# Altium project controller.PrjPcb
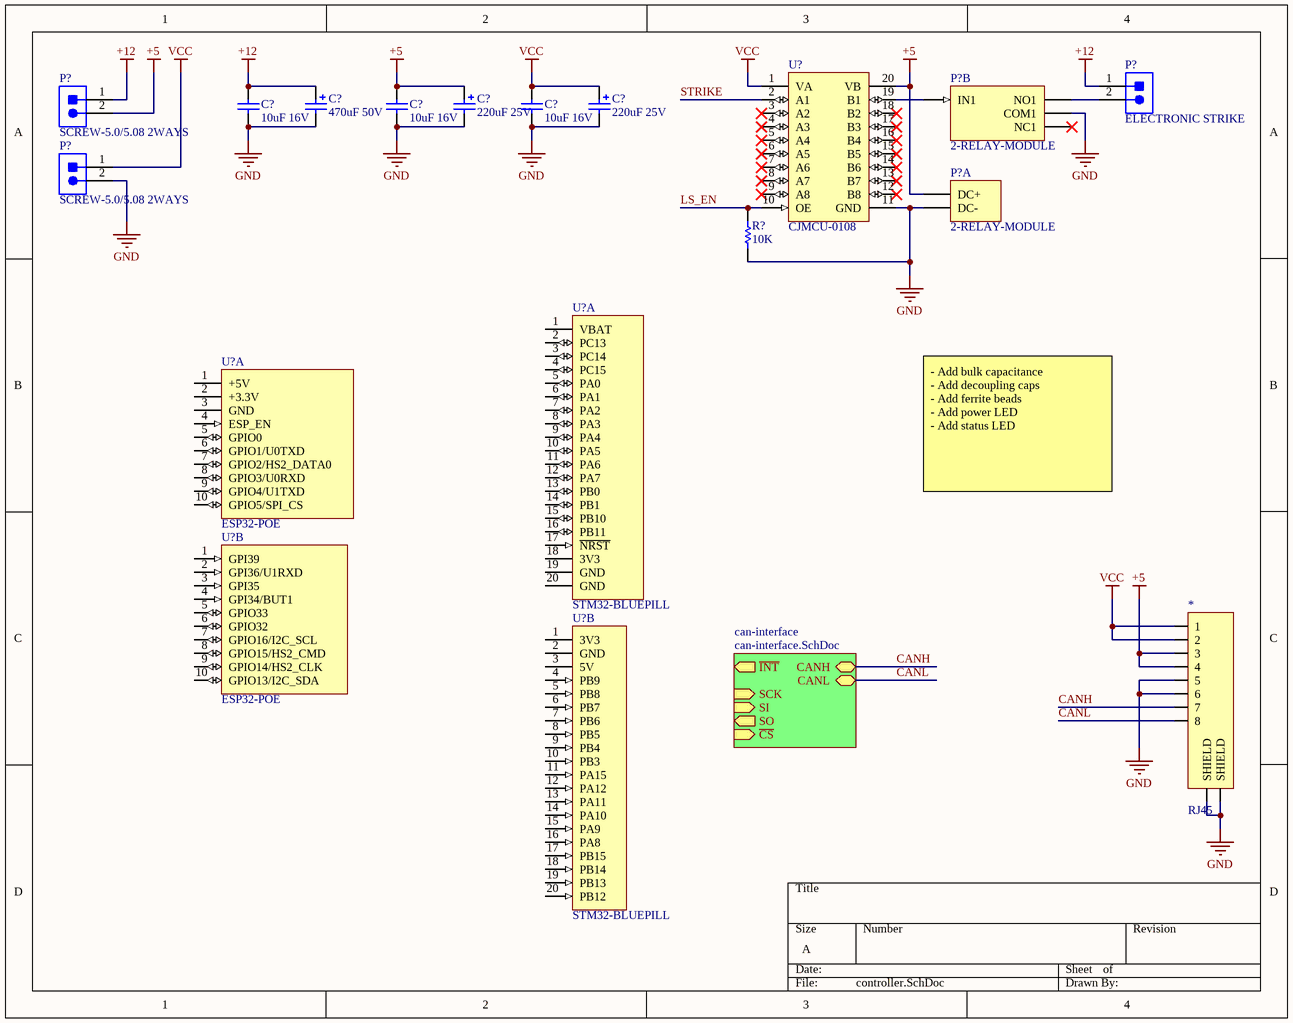
[diagram p0: controller.SchDoc]
3 sheets, 46 parts. Net scope: hierarchical (ports join the sheet entries above them; power ports are global).
Sheets:
  controller.SchDoc
    can-interface = can-interface.SchDoc
  keypad.SchDoc
    can-interface = can-interface.SchDoc

## Sheet controller.SchDoc
size A

### Parts
(Parts that share a designator on the sheet are numbered #1, #2 ... from top to bottom, then left to right.)
*  RJ45
C?#1  470uF 50V  [RB7.6-15]
C?#2  220uF 25V  [RB7.6-15]
C?#3  220uF 25V  [RB7.6-15]
C?#4  10uF 16V  [CAPC0805(2012)145_L]
C?#5  10uF 16V  [CAPC0805(2012)145_L]
C?#6  10uF 16V  [CAPC0805(2012)145_L]
P?#1  ELECTRONIC STRIKE  [SCREW-5.0-2WAYS_V]
P?#2  SCREW-5.0/5.08 2WAYS  [SCREW-5.0-2WAYS_V]
P?#3  2-RELAY-MODULE  (part B of 3)
P?#4  SCREW-5.0/5.08 2WAYS  [SCREW-5.0-2WAYS_V]
P?#5  2-RELAY-MODULE  (part A of 3)
R?  10K  [RESC0603(1608)_N]
U?#1  CJMCU-0108
U?#2  STM32-BLUEPILL  (part A of 2)
U?#3  ESP32-POE  (part A of 2)
U?#4  ESP32-POE  (part B of 2)
U?#5  STM32-BLUEPILL  (part B of 2)

### Sub-sheets
can-interface = can-interface.SchDoc: SO (out), SI (in), CANH (bidir), ~{CS} (in), CANL (bidir), SCK (in), ~{INT} (out)

### Nets
+5: *.3 *.4 C?#2.1 C?#5.2 P?#2.2 P?#5.1(DC+) U?#1.20(VB)
+12: C?#1.1 C?#4.2 P?#1.1 P?#2.1
GND: *.5 *.6 *.9(SHIELD) *.10(SHIELD) C?#1.2 C?#2.2 C?#3.2 C?#4.1 C?#5.1 C?#6.1 P?#3.3(COM1) P?#4.2 P?#5.2(DC-) R?.1 U?#1.11(GND)
VCC: *.1 *.2 C?#3.1 C?#6.2 P?#4.1 U?#1.1(VA)
CANH: *.7 ; sheet can-interface/CANH
CANL: *.8 ; sheet can-interface/CANL
LS_EN: R?.2 U?#1.10(OE)
STRIKE: U?#1.2(A1)
NetP?#1_2: P?#1.2 P?#3.2(NO1)
NetP?#3_1: P?#3.1(IN1) U?#1.19(B1)

Not connected (* = marked no-connect by the designer): P?#3 4(NC1)*; U?#1 3(A2)* 4(A3)* 5(A4)* 6(A5)* 7(A6)* 8(A7)* 9(A8)* 12(B8)* 13(B7)* 14(B6)* 15(B5)* 16(B4)* 17(B3)* 18(B2)*; U?#2 1(VBAT) 2(PC13) 3(PC14) 4(PC15) 5(PA0) 6(PA1) 7(PA2) 8(PA3) 9(PA4) 10(PA5) 11(PA6) 12(PA7) 13(PB0) 14(PB1) 15(PB10) 16(PB11) 17(~{NRST}) 18(3V3) 19(GND) 20(GND); U?#3 1(+5V) 2(+3.3V) 3(GND) 4(ESP_EN) 5(GPIO0) 6(GPIO1/U0TXD) 7(GPIO2/HS2_DATA0) 8(GPIO3/U0RXD) 9(GPIO4/U1TXD) 10(GPIO5/SPI_CS); U?#4 1(GPI39) 2(GPI36/U1RXD) 3(GPI35) 4(GPI34/BUT1) 5(GPIO33) 6(GPIO32) 7(GPIO16/I2C_SCL) 8(GPIO15/HS2_CMD) 9(GPIO14/HS2_CLK) 10(GPIO13/I2C_SDA); U?#5 1(3V3) 2(GND) 3(5V) 4(PB9) 5(PB8) 6(PB7) 7(PB6) 8(PB5) 9(PB4) 10(PB3) 11(PA15) 12(PA12) 13(PA11) 14(PA10) 15(PA9) 16(PA8) 17(PB15) 18(PB14) 19(PB13) 20(PB12)

### Notes on the sheet
- - Add bulk capacitance
  - Add decoupling caps
  - Add ferrite beads
  - Add power LED
  - Add status LED

### Library data of the parts
C?#1-C?#3 = Cap Pol1: Polarized Capacitor (Radial); Published: 8-Jun-2000; LatestRevisionDate: 17-Jul-2002; LatestRevisionNote: Re-released for DXP Platform.; PackageReference: RB7.6-15; Publisher: Altium Limited; PackageDescription: Polarized Capacitor (Radial); 2 Leads
  C?#1: Value: 470uF
  C?#2 C?#3: Value: 220uF
C?#4-C?#6 = CMP-1036-04927-1: CAP 10uF 16V ±10% 0805 (2012 Metric) Thickness 1.45mm SMD; Case-EIA: 0805; Tolerance: Â±10%; Case-Metric: 2012; Rated Voltage: 16 V; Technology: SMT; Value: 10uF; Max Thickness: 1.45 mm
P?#1 = CMP-0617-00009-1: Socket, Screw Terminal Block, 2 Way, 5.0 mm Pitch, 90 Degree Angle, Through-Hole; PartNumber: SCREW-5.0/5.08 2WAYS; Manufacturer: No Vendor; Insulation Resistance: 5000 MOhm / 1000 V; Contact Resistance: 20 mOhm; Rated Current: 25 A; Poles: 2; Rated Voltage: 300 V; ComponentLink1Description: Datasheet; ComponentLink1URL: 5mm screw terminal in SVN; Mounting Technology: Through Hole; PackageDescription: Socket, Screw Terminal Block, 2 Way, Pitch 5 mm, 90 Degree Angle, Through-Hole; Temperature Range: -40 to 105 degC
P?#2 P?#4 = CMP-0617-00009-1: Socket, Screw Terminal Block, 2 Way, 5.0 mm Pitch, 90 Degree Angle, Through-Hole; Manufacturer: No Vendor; Insulation Resistance: 5000 MOhm / 1000 V; Contact Resistance: 20 mOhm; Rated Current: 25 A; Poles: 2; Rated Voltage: 300 V; PartNumber: SCREW-5.0/5.08 2WAYS; ComponentLink1Description: Datasheet; ComponentLink1URL: 5mm screw terminal in SVN; Mounting Technology: Through Hole; PackageDescription: Socket, Screw Terminal Block, 2 Way, Pitch 5 mm, 90 Degree Angle, Through-Hole; Temperature Range: -40 to 105 degC
P?#3 P?#5 = 2-RELAY-MODULE: Dual relay module
R? = CMP-1012-00098-1: 10K 0.1W 5% 0603 (1608 Metric)  SMD; Case-EIA: 0603; Value: 10000.00 Ohm; Case-Metric: 1608; Technology: SMT; Tolerance: 5 %; Power: 0.1 W
U?#1 = CJMCU-0108: TXS0108E 8 channel logic level converter
U?#2 U?#5 = STM32-BLUEPILL: STM32 Bluepill
U?#3 U?#4 = ESP32-POE: Olimex ESP32-POE

## Sheet can-interface.SchDoc
size A
Used 2 times, as channels can-interface, can-interface. Parts and nets are listed once, with the designators drawn on the sheet.
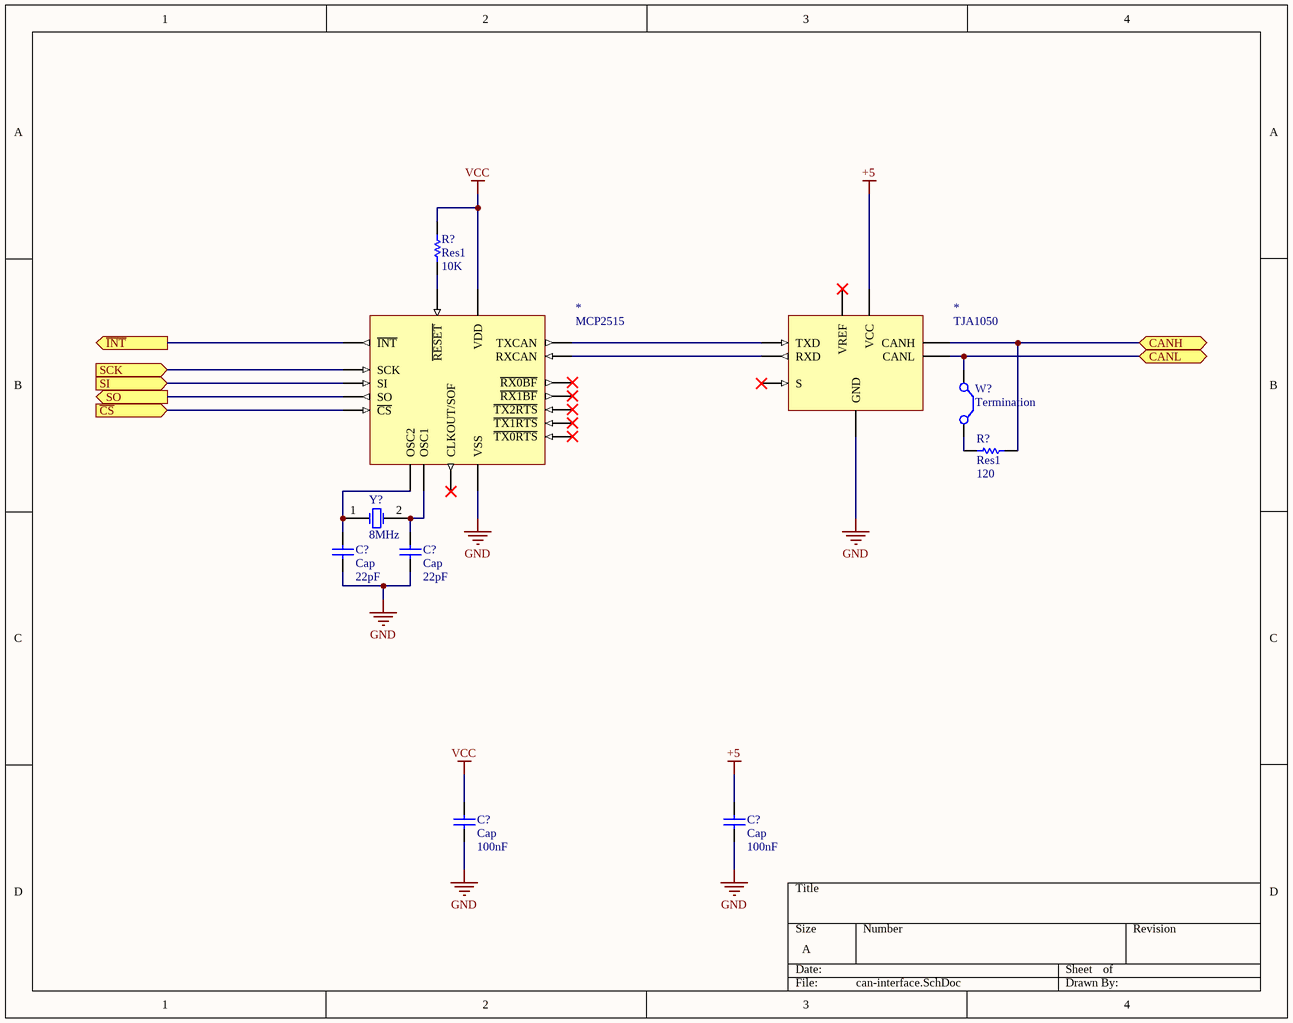
[diagram p1: can-interface.SchDoc]

### Parts
(Parts that share a designator on the sheet are numbered #1, #2 ... from top to bottom, then left to right.)
*#1  MCP2515
*#2  TJA1050
C?#1  Cap  value 22pF  [RAD-0.3]
C?#2  Cap  value 22pF  [RAD-0.3]
C?#3  Cap  value 100nF  [RAD-0.3]
C?#4  Cap  value 100nF  [RAD-0.3]
R?#1  Res1  value 10K  [AXIAL-0.3]
R?#2  Res1  value 120  [AXIAL-0.3]
W?  Termination  [RAD-0.2]
Y?  8MHz  [R38]

### Ports
CANH (bidir), CANL (bidir), SCK (in), SI (in), SO (out), ~{CS} (in), ~{INT} (out)

### Nets
+5: *#2.3(VCC) C?#4.2
GND: *#1.9(VSS) *#2.2(GND) C?#1.1 C?#2.1 C?#3.1 C?#4.1
VCC: *#1.18(VDD) C?#3.2 R?#1.2
~{CS}: *#1.16(~{CS}) ; port ~{CS}
CANH: *#2.7(CANH) R?#2.2 ; port CANH
CANL: *#2.6(CANL) W?.1(C1) ; port CANL
~{INT}: *#1.12(~{INT}) ; port ~{INT}
SCK: *#1.13(SCK) ; port SCK
SI: *#1.14(SI) ; port SI
SO: *#1.15(SO) ; port SO
Net*#1_1: *#1.1(TXCAN) *#2.1(TXD)
Net*#1_2: *#1.2(RXCAN) *#2.4(RXD)
Net*#1_7: *#1.7(OSC2) C?#1.2 Y?.1(OSC1)
Net*#1_8: *#1.8(OSC1) C?#2.2 Y?.2(OSC2)
Net*#1_17: *#1.17(~{RESET}) R?#1.1
NetR?#2_1: R?#2.1 W?.2(C2)

Not connected (* = marked no-connect by the designer): *#1 3(CLKOUT/SOF)* 4(~{TX0RTS})* 5(~{TX1RTS})* 6(~{TX2RTS})* 10(~{RX1BF})* 11(~{RX0BF})*; *#2 5(VREF)* 8(S)*

### Channels
can-interface: designators *=*_can-interface#1 *=*_can-interface#2 C?=C?_can-interface#1 C?=C?_can-interface#2 C?=C?_can-interface#3 C?=C?_can-interface#4 R?=R?_can-interface#1 R?=R?_can-interface#2 W?=W?_can-interface#1 Y?=Y?_can-interface#1; ports CANH=CANH CANL=CANL SCK=Net*_can-interface#1_13 SI=Net*_can-interface#1_14 SO=Net*_can-interface#1_15 ~{CS}=Net*_can-interface#1_16 ~{INT}=Net*_can-interface#1_12
can-interface: designators *=*_can-interface#3 *=*_can-interface#4 C?=C?_can-interface#5 C?=C?_can-interface#6 C?=C?_can-interface#7 C?=C?_can-interface#8 R?=R?_can-interface#3 R?=R?_can-interface#4 W?=W?_can-interface#2 Y?=Y?_can-interface#2; ports CANH=CANH CANL=CANL SCK=Net*_can-interface#3_13 SI=Net*_can-interface#3_14 SO=Net*_can-interface#3_15 ~{CS}=Net*_can-interface#3_16 ~{INT}=Net*_can-interface#3_12

### Library data of the parts
C?#1-C?#4 = Cap: Capacitor; Published: 8-Jun-2000; LatestRevisionDate: 17-Jul-2002; LatestRevisionNote: Re-released for DXP Platform.; PackageReference: RAD-0.3; Publisher: Altium Limited; PackageDescription: Radial Cap, Thru-Hole; 2 Leads; 0.3 in Pin Spacing
R?#1 R?#2 = Res1: Resistor; Published: 8-Jun-2000; LatestRevisionDate: 17-Jul-2002; LatestRevisionNote: Re-released for DXP Platform.; PackageReference: AXIAL-0.3; Publisher: Altium Limited; PackageDescription: Axial Device, Thru-Hole; 2 Leads; 0.3 in Pin Spacing
W? = Jumper: Jumper Wire; Published: 24-Mar-1999; LatestRevisionDate: 17-Jul-2002; LatestRevisionNote: Re-released for DXP Platform.; PackageReference: RAD-0.2; Publisher: Altium Limited; PackageDescription: Radial Cap, Thru-Hole; 2 Leads; 0.2 in Pin Spacing
Y? = XTAL: Crystal Oscillator; Published: 8-Jun-2000; LatestRevisionDate: 17-Jul-2002; LatestRevisionNote: Re-released for DXP Platform.; PackageReference: R38; Publisher: Altium Limited; PackageDescription: Crystal, Thru-Hole; 2 Leads; Body 3.1 x 8.2 mm (Dia.xH)

## Sheet keypad.SchDoc
size A
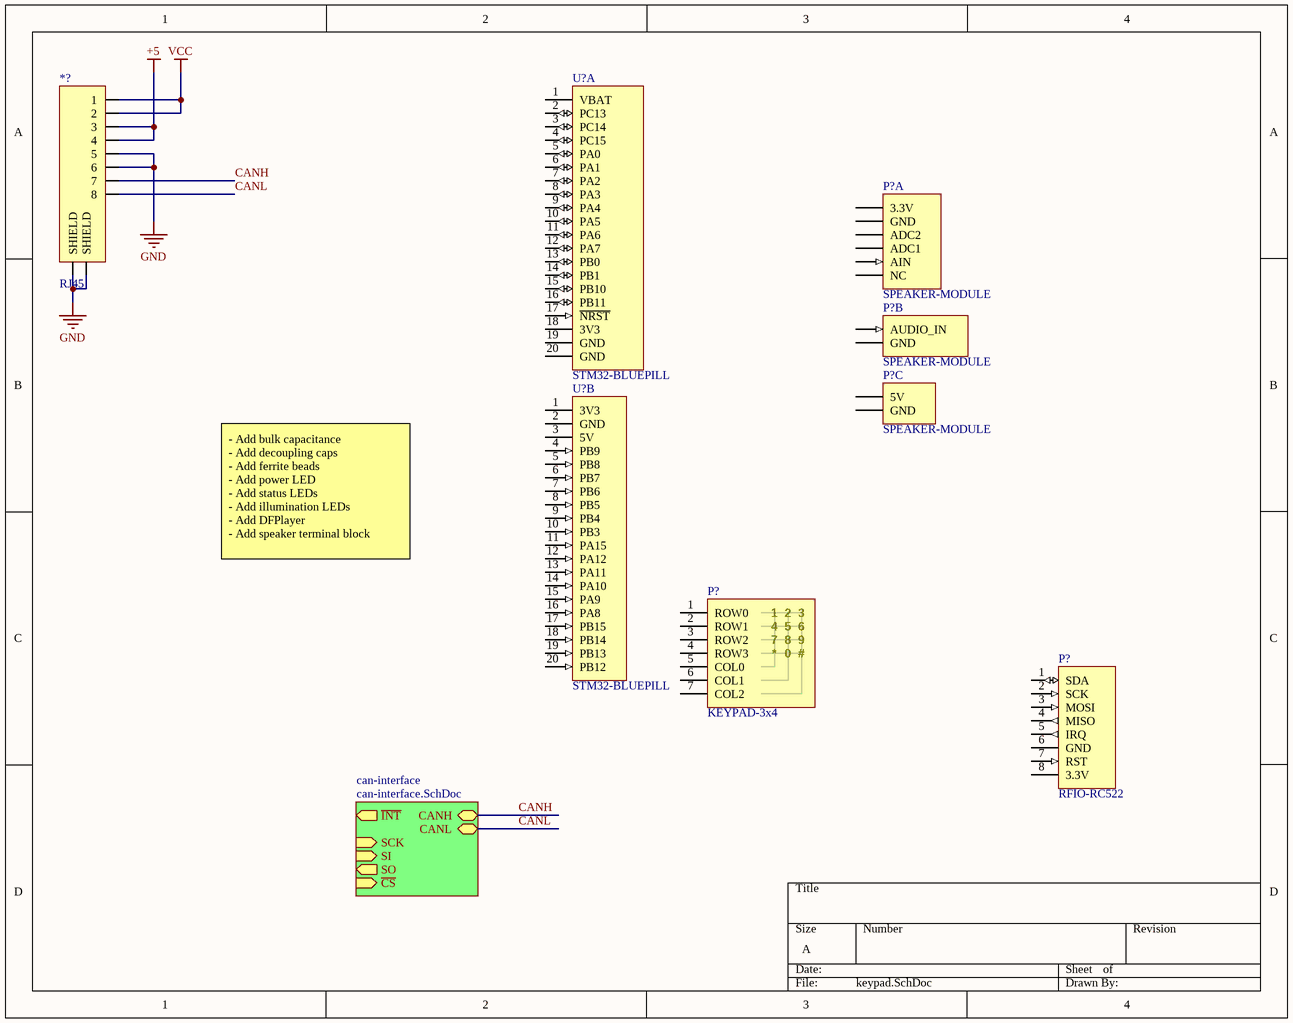
[diagram p2: keypad.SchDoc]

### Parts
(Parts that share a designator on the sheet are numbered #1, #2 ... from top to bottom, then left to right.)
*?  RJ45
P?#6  SPEAKER-MODULE  (part A of 3)
P?#7  SPEAKER-MODULE  (part B of 3)
P?#8  SPEAKER-MODULE  (part C of 3)
P?#9  KEYPAD-3x4
P?#10  RFIO-RC522
U?#6  STM32-BLUEPILL  (part A of 2)
U?#7  STM32-BLUEPILL  (part B of 2)

### Sub-sheets
can-interface = can-interface.SchDoc: SO (out), SI (in), CANH (bidir), ~{CS} (in), CANL (bidir), SCK (in), ~{INT} (out)

### Nets
+5: *?.3 *?.4
GND: *?.5 *?.6 *?.9(SHIELD) *?.10(SHIELD)
VCC: *?.1 *?.2
CANH: *?.7 ; sheet can-interface/CANH
CANL: *?.8 ; sheet can-interface/CANL

Not connected (* = marked no-connect by the designer): P?#6 1(3.3V) 2(GND) 3(ADC2) 4(ADC1) 5(AIN) 6(NC); P?#7 1(AUDIO_IN) 2(GND); P?#8 1(5V) 2(GND); P?#9 1(ROW0) 2(ROW1) 3(ROW2) 4(ROW3) 5(COL0) 6(COL1) 7(COL2); P?#10 1(SDA) 2(SCK) 3(MOSI) 4(MISO) 5(IRQ) 6(GND) 7(RST) 8(3.3V); U?#6 1(VBAT) 2(PC13) 3(PC14) 4(PC15) 5(PA0) 6(PA1) 7(PA2) 8(PA3) 9(PA4) 10(PA5) 11(PA6) 12(PA7) 13(PB0) 14(PB1) 15(PB10) 16(PB11) 17(~{NRST}) 18(3V3) 19(GND) 20(GND); U?#7 1(3V3) 2(GND) 3(5V) 4(PB9) 5(PB8) 6(PB7) 7(PB6) 8(PB5) 9(PB4) 10(PB3) 11(PA15) 12(PA12) 13(PA11) 14(PA10) 15(PA9) 16(PA8) 17(PB15) 18(PB14) 19(PB13) 20(PB12)

### Notes on the sheet
- - Add bulk capacitance
  - Add decoupling caps
  - Add ferrite beads
  - Add power LED
  - Add status LEDs
  - Add illumination LEDs
  - Add DFPlayer
  - Add speaker terminal block
- (in symbol KEYPAD-3x4) 8; 9; 0; #

### Library data of the parts
P?#6-P?#8 = SPEAKER-MODULE: Speaker
P?#9 = KEYPAD-3x4: 3x4 matrix keypad
P?#10 = RFIO-RC522: RFIO-RC522 MFRC522
U?#6 U?#7 = STM32-BLUEPILL: STM32 Bluepill

## Nets that join several sheets
+5: controller (7 pins), can-interface (*_can-interface#2.3 C?_can-interface#4.2), keypad (*?.3 *?.4), can-interface (*_can-interface#4.3 C?_can-interface#8.2)
GND: controller (15 pins), can-interface (6 pins), keypad (*?.5 *?.6 *?.9 *?.10), can-interface (6 pins)
VCC: controller (6 pins), can-interface (*_can-interface#1.18 C?_can-interface#3.2 R?_can-interface#1.2), keypad (*?.1 *?.2), can-interface (*_can-interface#3.18 C?_can-interface#7.2 R?_can-interface#3.2)
CANH: controller (*.7), can-interface (*_can-interface#2.7 R?_can-interface#2.2)
CANH: keypad (*?.7), can-interface (*_can-interface#4.7 R?_can-interface#4.2)
CANL: controller (*.8), can-interface (*_can-interface#2.6 W?_can-interface#1.1)
CANL: keypad (*?.8), can-interface (*_can-interface#4.6 W?_can-interface#2.1)